# Altium schematic sheet GNSS EN Signal Control.SchDoc: On / Off Signal Control
size 292 x 193 mm; SheetNumber: 8; SheetTotal: 15
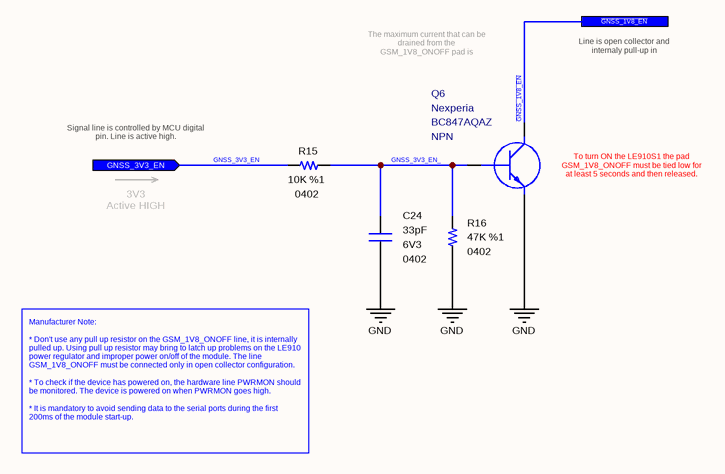
[diagram p0: GNSS EN Signal Control.SchDoc]

## Parts
C24  value 33pF  Case: 0402  Voltage: 6V3  [CAPACITOR_0402]
Q6  Polarity: NPN  Manufacturer Part Number: BC847AQAZ  Manufacturer Name: Nexperia  [SOT1215]
R15  value 10K  Case: 0402  Tolerance: %1  [RESISTOR_0402]
R16  value 47K  Case: 0402  Tolerance: %1  [RESISTOR_0402]

## Ports
GNSS_3V3_EN (in), ~{GNSS_1V8_EN}

## Nets
GND: C24.1 Q6.2(E) R16.1
~{GNSS_1V8_EN}: Q6.3(C) ; port ~{GNSS_1V8_EN}
GNSS_3V3_EN: R15.2 ; port GNSS_3V3_EN
GNSS_3V3_EN_: C24.2 Q6.1(B) R15.1 R16.2

## Notes on the sheet
- The maximum current that can be drained from the GSM_1V8_ONOFF pad is 0.12mA.
- Line is open collector and internaly pull-up in LE910S1.
- Signal line is controlled by MCU digital pin. Line is active high.
- (near Q6) To turn ON the LE910S1 the pad GSM_1V8_ONOFF must be tied low for at least 5 seconds and then released.
- 3V3
  Active HIGH
- Manufacturer Note:
  * Don't use any pull up resistor on the GSM_1V8_ONOFF line, it is internally pulled up. Using pull up resistor may bring to latch up problems on the LE910 power regulator and improper power on/off of the module. The line GSM_1V8_ONOFF must be connected only in open collector configuration.
  * To check if the device has powered on, the hardware line PWRMON should be monitored. The device is powered on when PWRMON goes high.
  * It is mandatory to avoid sending data to the serial ports during the first 200ms of the module start-up.
- © 2021 All rights reserved.
  This document may not, in whole or in part, be copied, photocopied, reproduced, translated or converted to any electronic or machine readable from without prior written permission of Mehmet Günce Akkoyun.
  Engineer contact : akkoyun@me.com
- Property of
- Engineer :
- Date :
- Size :
- A4
- Time :
- Project :
- Page :
- /
- Customer :
- Product ID :
- Module ID :
- Version :
- File :
- Revision :

## Library data of the parts
C24 = 33pF [0402-6V3]: Capacitor - 33pF [0402] (Ceramic); Manufacturer Part Number: C0402C330J9RACAUTO; Manufacturer Name: Kemet; Dielectric: X7R; Tolerance: 10%; Height: 0.5mm; Maximum Operating Temperature: +125; Minimum Operating Temperature: -55; ROHS: Yes; ComponentLink1Description: DataSheet; ComponentLink1URL: https://api.kemet.com/component-edge/download/datasheet/C0402C330J9RACAUTO.pdf; ComponentLink2Description: Mouser; ComponentLink2URL: https://www.mouser.com/Search/Refine.aspx?Keyword=80-C0402C330J9RAUTO
Q6 = BC847: Bipolar NPN Transistors; Case: DFN-1010D-3
R15 = 10K: Thick Film Resistors - SMD 1/16 W 10 Kohms 1%; Manufacturer Name: Vishay; Manufacturer Part Number: CRCW040210K0FKED; Height: 0.4mm; ComponentLink1Description: DataSheet; ComponentLink1URL: https://www.mouser.com.tr/datasheet/2/427/dcrcwe3-1762152.pdf; ComponentLink2Description: Mouser; ComponentLink2URL: https://www.mouser.com.tr/ProductDetail/Vishay-Dale/CRCW040210K0FKED?qs=sGAEpiMZZMu61qfTUdNhG2DpbjADlD3GcalbOv9utCY%3D
R16 = 47K: Thick Film Resistors - SMD 1/16 W 47 Kohms 1%; Manufacturer Name: Vishay; Manufacturer Part Number: CRCW040247K0FKED; ComponentLink1URL: https://www.mouser.com.tr/datasheet/2/427/dcrcwe3-1762152.pdf; ComponentLink1Description: DataSheet; Height: 0.4mm; ComponentLink2Description: Mouser; ComponentLink2URL: https://www.mouser.com.tr/ProductDetail/Vishay-Dale/CRCW040247K0FKED?qs=sGAEpiMZZMu61qfTUdNhG2DpbjADlD3GL%252B3h1elTxqU%3D